# Altium schematic sheet 32 MEC.SchDoc
size 386 x 246 mm
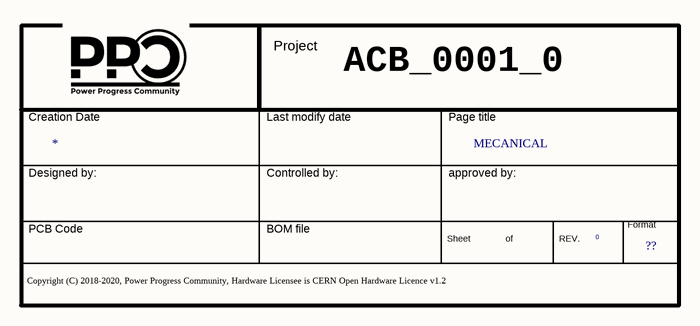
[diagram p0: 32 MEC.SchDoc]

## Parts
*  Doc: MECANICAL  Page Size: ??  RevCode: 0  (hidden comment: Title_block_PPC)  (graphical)

## Notes on the sheet
- ACB_0001_0
- (in symbol Title_block_PPC) Project; Creation Date; Last modify date; Page title; Designed by:; Controlled by:; approved by:; Format; PCB Code; BOM file; Sheet; of; REV.; Copyright (C) 2018-2020, Power Progress Community, Hardware Licensee is CERN Open Hardware Licence v1.2

## Library data of the parts
* = Title_block_PPC: Page Count: 45; Page Number: 44; Title: T2080PCIe; Author: MICETEK; Page Create Date: March  8, 1995; Page Title: ?; Page Modify Date: *; Schematic Page Count: 45; Schematic Page Number: 44